# EAGLE design ME433_PCB (EAGLE 8.1.0)
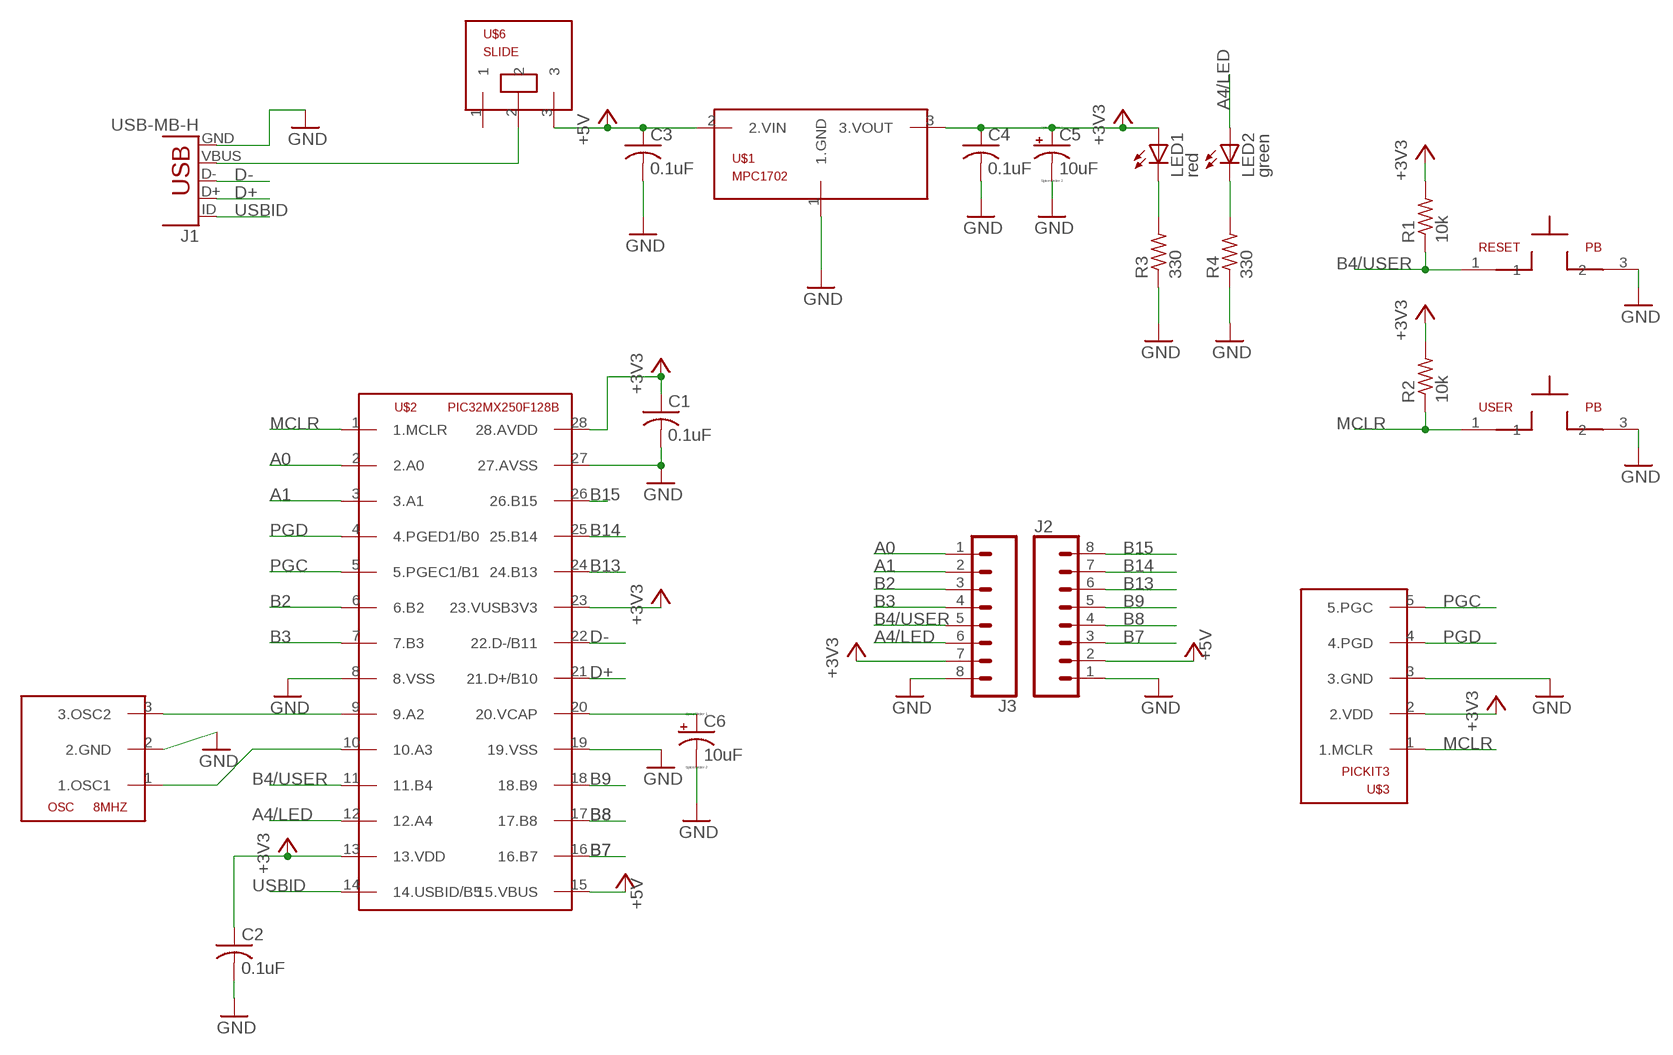
[diagram p0: schematic, sheet 1]

## Parts
8MHZ  OSC  [OSC]
C1  0.1uF  C-US025-025X050  [C025-025X050]
C2  0.1uF  C-US025-025X050  [C025-025X050]
C3  0.1uF  C-US025-025X050  [C025-025X050]
C4  0.1uF  C-US025-025X050  [C025-025X050]
C5  10uF  CPOL-USB45181B  [B45181B]
C6  10uF  CPOL-USB45181B  [B45181B]
J1  USB-MB-H  [USB-MB-H]
J2  CONN_08"  [1X08]
J3  CONN_08"  [1X08]
LED1  red  LED3MM  [LED3MM]
LED2  green  LED3MM  [LED3MM]
R1  10k  R-US_0207/10  [0207/10]
R2  10k  R-US_0207/10  [0207/10]
R3  330  R-US_0207/10  [0207/10]
R4  330  R-US_0207/10  [0207/10]
RESET  PB  [PB]
U$1  MPC1702  [TO92]
U$2  PIC32MX250F128B  [DIL28-3]
U$3  PICKIT3  [1X05]
U$6  SLIDE  [SLIDE]
USER  PB  [PB]

## Nets
+3V3: C1.1 C2.1 C4.1 C5.+ J3.7 LED1.A R1.2 R2.2 U$1.3(3.VOUT) U$2.13(13.VDD) U$2.23(23.VUSB3V3) U$2.28(28.AVDD) U$3.2(2.VDD)
+5V: C3.1 J2.2 U$1.2(2.VIN) U$2.15(15.VBUS) U$6.3
A0: J3.1 U$2.2(2.A0)
A1: J3.2 U$2.3(3.A1)
A4/LED: J3.6 LED2.A U$2.12(12.A4)
B2: J3.3 U$2.6(6.B2)
B3: J3.4 U$2.7(7.B3)
B4/USER: J3.5 R1.1 RESET.1 U$2.11(11.B4)
B7: J2.3 U$2.16(16.B7)
B8: J2.4 U$2.17(17.B8)
B9: J2.5 U$2.18(18.B9)
B13: J2.6 U$2.24(24.B13)
B14: J2.7 U$2.25(25.B14)
B15: J2.8 U$2.26(26.B15)
D+: J1.D+ U$2.21(21.D+/B10)
D-: J1.D- U$2.22(22.D-/B11)
GND: 8MHZ.2(2.GND) C1.2 C2.2 C3.2 C4.2 C5.- C6.- J1.GND J2.1 J3.8 R3.1 R4.1 RESET.3 U$1.1(1.GND) U$2.8(8.VSS) U$2.19(19.VSS) U$2.27(27.AVSS) U$3.3(3.GND) USER.3
MCLR: R2.1 U$2.1(1.MCLR) U$3.1(1.MCLR) USER.1
N$1: J1.VBUS U$6.2
N$2: 8MHZ.3(3.OSC2) U$2.9(9.A2)
N$3: LED1.K(C) R3.2
N$4: LED2.K(C) R4.2
N$11: C6.+ U$2.20(20.VCAP)
N$12: 8MHZ.1(1.OSC1) U$2.10(10.A3)
PGC: U$2.5(5.PGEC1/B1) U$3.5(5.PGC)
PGD: U$2.4(4.PGED1/B0) U$3.4(4.PGD)
USBID: J1.ID U$2.14(14.USBID/B5)
Unconnected: U$6.1

## Library data of the parts
8MHZ = MCP1702:OSC
C1-C4 = MCP1702:C-US: CAPACITOR, American symbol
C5 C6 = MCP1702:CPOL-US: POLARIZED CAPACITOR, American symbol
J1 = MCP1702:USB: USB Connectors USB-B-PTH is fully proven SKU : PRT-00139/CONN-08278 USB-miniB is fully proven SKU : PRT-00587 USB-A-PCB is untested. USB-A-H is throughly reviewed, but untested. Spark Fun Electronics SKU : PRT-00437 USB-B-SMT is throughly reviewed, but untested. Needs silkscreen touching up. USB-A-S has not been used/tested USB-MB-H has not been used/tested USB-MICROB has been used. CONN-09505
J2 J3 = MCP1702:CONN_08: Multi connection point. Often used as Generic Header-pin footprint for 0.1 inch spaced/style header connections On any of the 0.1 inch spaced packages, you can populate with these: Break Away Headers - Straight <https://www.sparkfun.com/products/116> (PRT-00116) Break Away Male Headers - Right Angle <https://www.sparkfun.com/products/553> (PRT-00553) Female Headers <https://www.sparkfun.com/products/115> (PRT-00115) Break Away Headers - Machine Pin <https://www.sparkfun.com/products/117> (PRT-00117) Break Away Female Headers - Swiss Machine Pin <https://www.sparkfun.com/products/743> (PRT-00743) Arduino Stackable Header - 8 Pin <https://www.sparkfun.com/products/9279> (PRT-09279) For SCREWTERMINALS and SPRING TERMINALS visit here: Screw Terimnals on SparkFun.com <https://www.sparkfun.com/search/results?term=Screw+Terminals> (5mm/3.5mm/2.54mm spacing) This device is also useful as a general connection point to wire up your design to another part of your project. Our various solder wires solder well into these plated through hole pads. Hook-Up Wire - Assortment (Stranded, 22 AWG) <https://www.sparkfun.com/products/11375> (PRT-11375) Hook-Up Wire - Assortment (Solid Core, 22 AWG) <https://www.sparkfun.com/products/11367> (PRT-11367) View the entire wire category on our website here <https://www.sparkfun.com/categories/141> Special notes: Molex polarized connector foot print use with SKU : PRT-08231 with associated crimp pins and housings. 1MM SMD Version SKU: PRT-10208 NOTES ON THE VARIANTS LOCK and LOCK_LONGPADS... This footprint was designed to help hold the alignment of a through-hole component (i.e. 6-pin header) while soldering it into place. You may notice that each hole has been shifted either up or down by 0.005 of an inch from it's more standard position (which is a perfectly straight line). This slight alteration caused the pins (the squares in the middle) to touch the edges of the holes. Because they are alternating, it causes a "brace" to hold the component in place. 0.005 has proven to be the perfect amount of "off-center" position when using our standard breakaway headers. Although looks a little odd when you look at the bare footprint, once you have a header in there, the alteration is very hard to notice. Also,if you push a header all the way into place, it is covered up entirely on the bottom side.; PROD_ID: CONN-08438
LED1 LED2 = led:LED: LED OSRAM: - CHIPLED LG R971, LG N971, LY N971, LG Q971, LY Q971, LO R971, LY R971 LH N974, LH R974 LS Q976, LO Q976, LY Q976 LO Q996 - Hyper CHIPLED LW Q18S LB Q993, LB Q99A, LB R99A - SideLED LS A670, LO A670, LY A670, LG A670, LP A670 LB A673, LV A673, LT A673, LW A673 LH A674 LY A675 LS A676, LA A676, LO A676, LY A676, LW A676 LS A679, LY A679, LG A679 - Hyper Micro SIDELED® LS Y876, LA Y876, LO Y876, LY Y876 LT Y87S - SmartLED LW L88C, LW L88S LB L89C, LB L89S, LG L890 LS L89K, LO L89K, LY L89K LS L896, LA L896, LO L896, LY L896 - TOPLED LS T670, LO T670, LY T670, LG T670, LP T670 LSG T670, LSP T670, LSY T670, LOP T670, LYG T670 LG T671, LOG T671, LSG T671 LB T673, LV T673, LT T673, LW T673 LH T674 LS T676, LA T676, LO T676, LY T676, LB T676, LH T676, LSB T676, LW T676 LB T67C, LV T67C, LT T67C, LS T67K, LO T67K, LY T67K, LW E67C LS E67B, LA E67B, LO E67B, LY E67B, LB E67C, LV E67C, LT E67C LW T67C LS T679, LY T679, LG T679 LS T770, LO T770, LY T770, LG T770, LP T770 LB T773, LV T773, LT T773, LW T773 LH T774 LS E675, LA E675, LY E675, LS T675 LS T776, LA T776, LO T776, LY T776, LB T776 LHGB T686 LT T68C, LB T68C - Hyper Mini TOPLED® LB M676 - Mini TOPLED Santana® LG M470 LS M47K, LO M47K, LY M47K Source: http://www.osram.convergy.de LUXEON: - LUMILED® LXK2-PW12-R00, LXK2-PW12-S00, LXK2-PW14-U00, LXK2-PW14-V00 LXK2-PM12-R00, LXK2-PM12-S00, LXK2-PM14-U00 LXK2-PE12-Q00, LXK2-PE12-R00, LXK2-PE12-S00, LXK2-PE14-T00, LXK2-PE14-U00 LXK2-PB12-K00, LXK2-PB12-L00, LXK2-PB12-M00, LXK2-PB14-N00, LXK2-PB14-P00, LXK2-PB14-Q00 LXK2-PR12-L00, LXK2-PR12-M00, LXK2-PR14-Q00, LXK2-PR14-R00 LXK2-PD12-Q00, LXK2-PD12-R00, LXK2-PD12-S00 LXK2-PH12-R00, LXK2-PH12-S00 LXK2-PL12-P00, LXK2-PL12-Q00, LXK2-PL12-R00 Source: www.luxeon.com KINGBRIGHT: KA-3528ASYC Source: www.kingbright.com
R1-R4 = MCP1702:R-US_: RESISTOR, American symbol
RESET USER = MCP1702:PB
U$1 = ME433_project:MPC1702
U$2 = MCP1702:PIC32MX250F128B
U$3 = MCP1702:PICKIT3
U$6 = MCP1702:SLIDE

## Net classes
0 default: clearance 0.305 mm

## Board
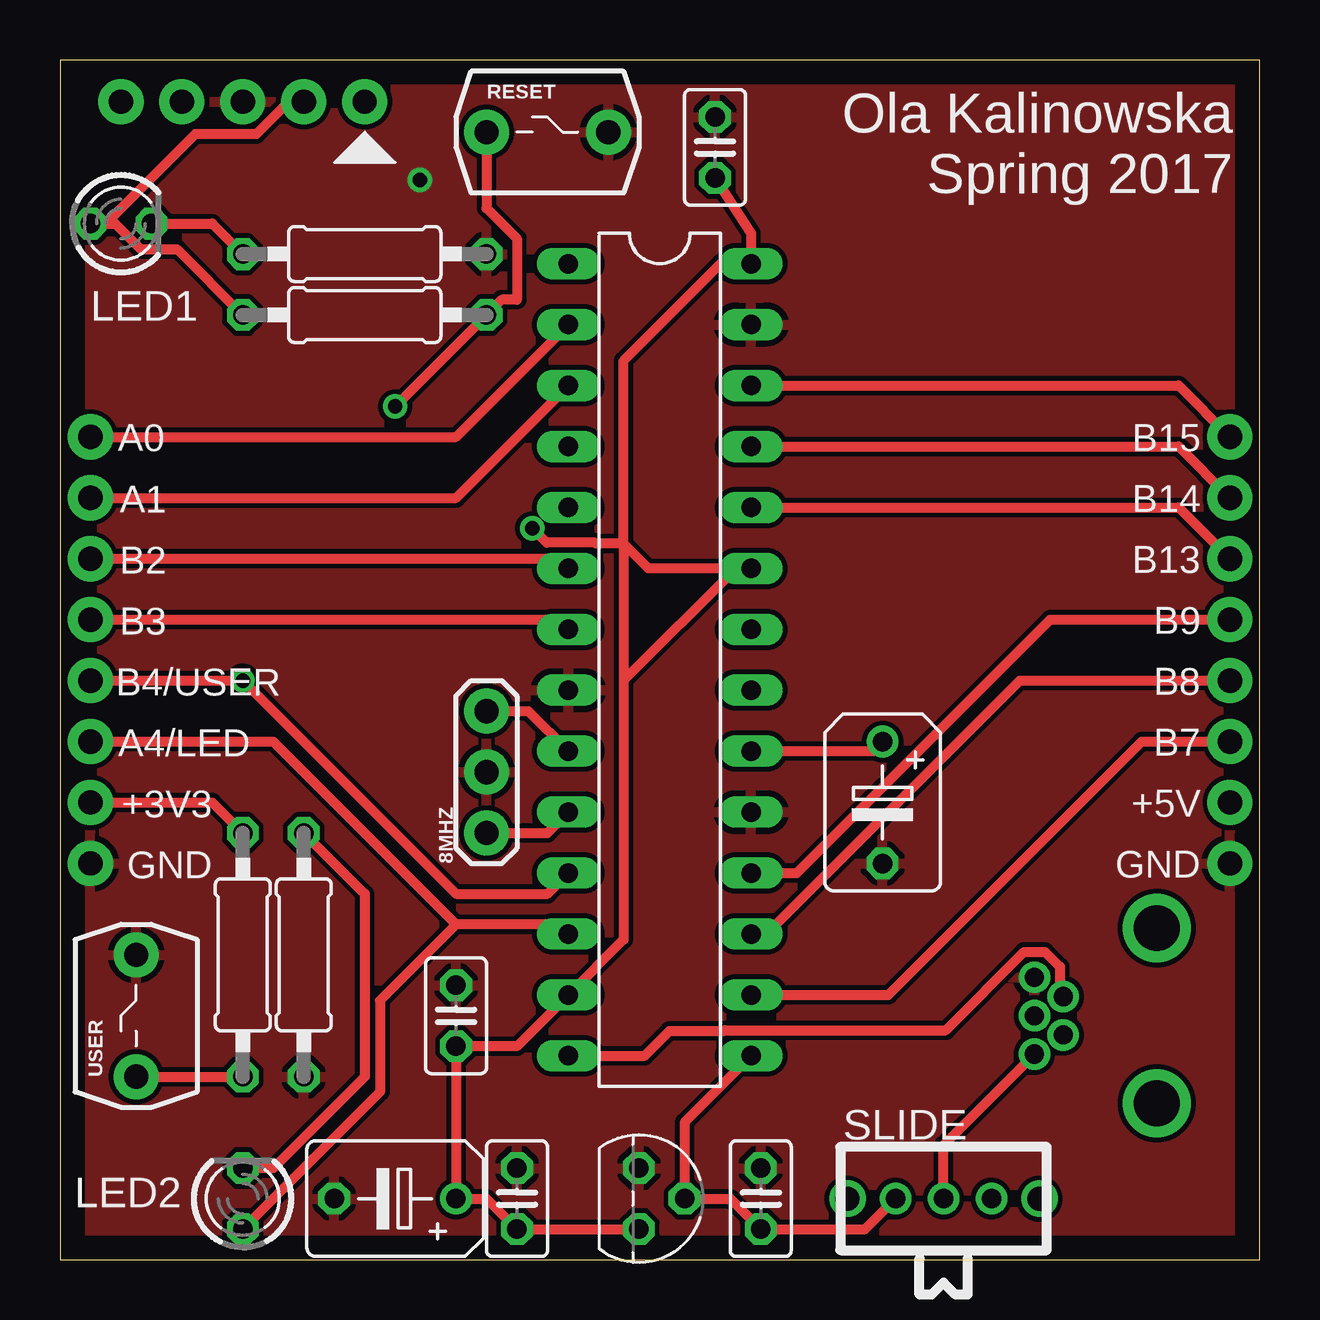
[diagram p1: board, top side]
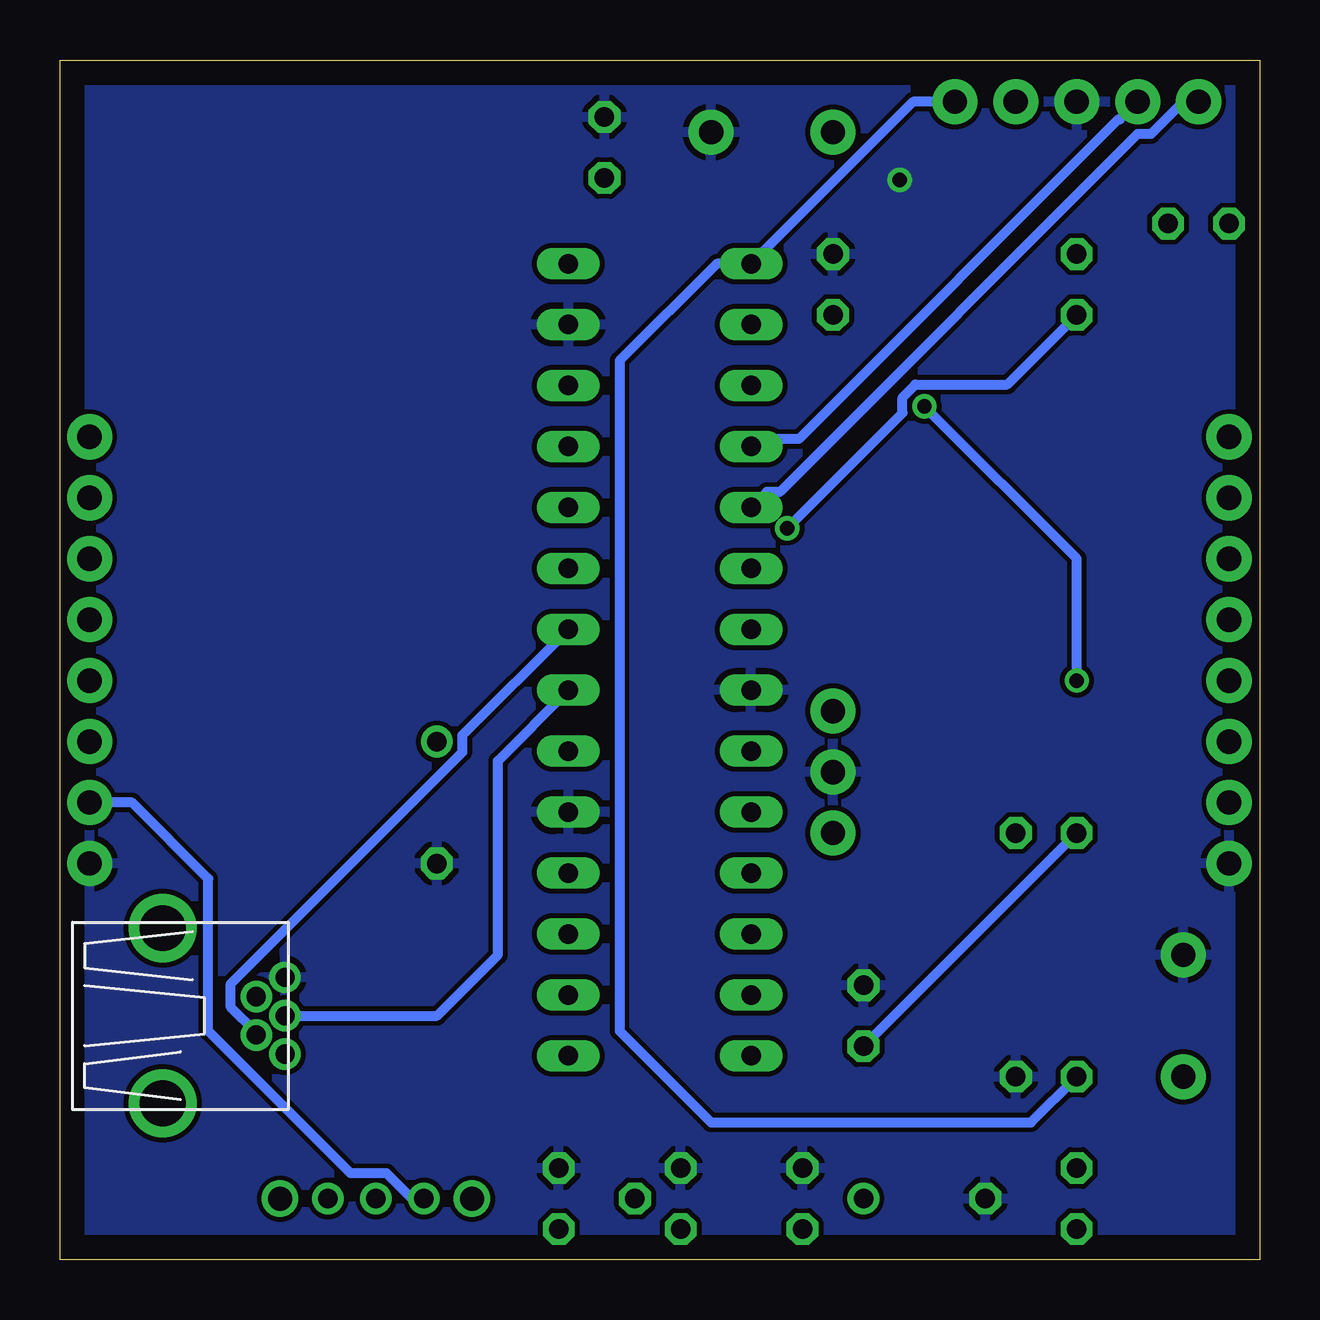
[diagram p2: board, bottom side, seen from below]

Size 50 x 50 mm. Coordinates in mm from the lower left corner, seen from the top.
Outline: 0,0 50,0 50,50 0,50 0,0
Copper layers (1*16): Top 0.035mm / dielectric 1.5mm / Bottom 0.035mm
Design rules "default": minimum track width 10mil, minimum drill 24mil, track to track 8mil, track to pad 8mil, pad to pad 8mil, via to via 8mil, smd to smd 8mil, copper to edge 40mil, drill to drill 8mil, minimum pad ring 10mil, minimum via ring 8mil, stop-mask expansion 4mil, vias tented up to drill 0mil, thermal gap 10mil

### Footprints (pad centres in the part's own frame; a part is rotated, then mirrored left to right if it is on the bottom)
OSC = drill 1.016 pad 1.88: 1 -2.54,0; 2 0,0; 3 2.54,0
C025-025X050 = drill 0.813 octagon: 1 -1.27,0; 2 1.27,0
B45181B = drill 0.813: + -2.54,0 | drill 0.813 octagon: - 2.54,0
USB-MB-H = drill 0.8: D+ 5.1,0; D- 3.9,0.8; GND 5.1,-1.6; ID 3.9,-0.8; VBUS 5.1,1.6 | drill 1.9: P$6 0,-3.65; P$7 0,3.65
1X08 = drill 1.016 pad 1.88: 1 0,0; 2 2.54,0; 3 5.08,0; 4 7.62,0; 5 10.16,0; 6 12.7,0; 7 15.24,0; 8 17.78,0
LED3MM = drill 0.813 octagon: A -1.27,0; K 1.27,0
0207/10 = drill 0.813 octagon: 1 -5.08,0; 2 5.08,0
PB = drill 1.016 pad 1.88: 1 -2.54,0; 3 2.54,0
TO92 = drill 0.813 octagon: 1 -1.27,0; 2 0,1.905; 3 1.27,0
DIL28-3 = drill 0.813 long: 1 -16.51,-3.81; 2 -13.97,-3.81; 3 -11.43,-3.81; 4 -8.89,-3.81; 5 -6.35,-3.81; 6 -3.81,-3.81; 7 -1.27,-3.81; 8 1.27,-3.81; 9 3.81,-3.81; 10 6.35,-3.81; 11 8.89,-3.81; 12 11.43,-3.81; 13 13.97,-3.81; 14 16.51,-3.81; 15 16.51,3.81; 16 13.97,3.81; 17 11.43,3.81; 18 8.89,3.81; 19 6.35,3.81; 20 3.81,3.81; 21 1.27,3.81; 22 -1.27,3.81; 23 -3.81,3.81; 24 -6.35,3.81; 25 -8.89,3.81; 26 -11.43,3.81; 27 -13.97,3.81; 28 -16.51,3.81
1X05 = drill 1.016 pad 1.88: 1 0,0; 2 2.54,0; 3 5.08,0; 4 7.62,0; 5 10.16,0
SLIDE = drill 0.8: 1 -2,0; 2 0,0; 3 2,0 | drill 1: P$1 -4,0; P$2 4,0

### Placement (x,y rotation side)
8MHZ  17.78,20.32 90 top
C1  27.3,46.35 90 top
C2  19.05,2.54 90 top
C3  29.21,2.54 90 top
C4  16.51,10.16 90 top
C5  13.97,2.54 180 top
C6  34.29,19.05 270 top
J1  45.72,10.16 180 top
J2  48.77,16.51 90 top
J3  1.27,34.29 270 top
LED1  2.54,43.18 0 top
LED2  7.62,2.54 90 top
R1  12.7,39.37 180 top
R2  7.62,12.7 90 top
R3  12.7,41.91 180 top
R4  10.16,12.7 90 top
RESET  20.32,46.99 0 top
U$1  24.13,2.54 270 top
U$2  25,25 270 top
U$3  12.7,48.26 180 top
U$6  36.83,2.54 180 top
USER  3.17,10.16 90 top

### Tracks (layer width: path | path; a pad name or v marks a point on that pad's centre or on a via)
+3V3  (via drill 0.6)
  Top 0.406: C1.1 28.81,42.78 U$2.28 27.54,41.51 23.5,37.47 23.5,29.84 | 23.5,29.84 23.5,24.13 | 23.5,24.13 23.5,13.34 U$2.13 19.05,8.89 C4.1 C5.+ 17.78,2.54 C2.1 U$1.3 | 23.5,24.13 28.18,28.81 U$2.23 24.53,28.81 23.5,29.84 | J3.7 6.35,19.05 R2.2 | 1.91,43.18 LED1.A | 1.91,43.18 2.3,43.18 3.37,42.11 4.88,42.11 R1.2 | U$3.2 9.52,48.26 8.18,46.91 5.64,46.91 1.91,43.18 | 23.5,29.84 22.32,29.84 22.29,29.88 20.29,29.88 v19.68,30.48
  Bottom 0.406: R2.2 C4.1 | v19.68,30.48 14.88,35.28 14.88,35.94 14.35,36.47 10.52,36.47 R1.2
+5V
  Top 0.406: U$2.15 26.04,5.71 U$1.2 27.94,2.54 C3.1 33.56,1.27 U$6.3
  Bottom 0.406: U$6.3 35.33,2.54 36.39,3.6 37.89,3.6 43.81,9.53 43.81,15.88 46.99,19.05 J2.2
A0
  Top 0.406: J3.1 16.51,34.29 U$2.2
A1
  Top 0.406: J3.2 16.51,31.75 U$2.3
A4/LED
  Top 0.406: J3.6 8.89,21.59 16.51,13.97 | 16.51,13.97 20.79,13.97 U$2.12 | 16.51,13.97 13.34,10.79 13.34,6.99 LED2.A
B2
  Top 0.406: J3.3 20.79,29.21 U$2.6
B3
  Top 0.406: J3.4 20.79,26.67 U$2.7
B4/USER  (via drill 0.6)
  Top 0.406: J3.5 v7.62,24.13 16.51,15.24 20.32,15.24 U$2.11 | v13.97,35.56 R1.1 18.41,40.01 19.05,40.01 19.05,42.55 17.78,43.81 RESET.1
  Bottom 0.406: v7.62,24.13 7.62,29.21 v13.97,35.56
B7
  Top 0.406: U$2.16 34.52,11.03 45.09,21.59 J2.3
B8
  Top 0.406: U$2.17 29.45,13.57 40.01,24.13 J2.4
B9
  Top 0.406: U$2.18 30.71,16.11 41.27,26.67 J2.5
B13
  Top 0.406: U$2.24 46.63,31.35 J2.6
B14
  Top 0.406: U$2.25 46.63,33.89 J2.7
B15
  Top 0.406: U$2.26 46.63,36.43 J2.8
D+
  Bottom 0.406: J1.D+ 34.29,10.16 31.75,12.7 31.75,20.79 U$2.21
D-
  Bottom 0.406: U$2.22 33.22,21.86 33.22,21.15 42.88,11.49 42.88,10.52 41.82,9.46 J1.D-
GND  (via drill 0.6)
  other vias: 15,45
  pour Top: 0,50 50,50 50,0 0,0
  pour Bottom: 0,50 0,0 50,0 50,50
MCLR
  Top 0.406: USER.1 R2.1
  Bottom 0.406: U$3.1 14.44,48.26 U$2.1 22.62,41.51 26.67,37.47 26.67,9.53 22.86,5.71 9.53,5.71 R2.1
N$1
  Top 0.406: U$6.2 36.83,4.77 J1.VBUS
N$2
  Top 0.406: 8MHZ.3 19.52,22.86 U$2.9
N$3
  Top 0.406: LED1.K 6.35,43.18 R3.2
N$4
  Top 0.406: R4.2 12.7,15.24 12.7,7.62 8.89,3.81 LED2.K
N$11
  Top 0.406: U$2.20 33.89,21.19 C6.+
N$12
  Top 0.406: 8MHZ.1 20.32,17.78 U$2.10
PGC
  Bottom 0.406: U$3.5 3.18,48.26 4.52,46.91 5.09,46.91 20,32 20.54,32 U$2.5
PGD
  Bottom 0.406: U$3.4 5.82,47.52 5.88,47.52 19.2,34.2 20.88,34.2 U$2.4
USBID
  Top 0.406: U$2.14 24.36,8.49 25.4,9.53 27.68,9.53 27.71,9.56 36.92,9.56 40.18,12.82 41.06,12.82 41.68,12.2 41.68,11.1 J1.ID

### Text on the board
tPlace: Ola Kalinowska / Spring 2017 | A0 | B15 | A1 | B14 | B2 | B13 | B3 | B9 | B8 | B4/USER | A4/LED | B7 | +3V3 | +5V | GND | GND